# Altium schematic sheet RX_DP.SchDoc
size 431 x 279 mm; Organization: ORGANIZATION; Address1: ADDRESS 1; Address2: ADDRESS 2; Address3: ADDRESS 3; Address4: ADDRESS 4; Revision: -; SheetNumber: 1; SheetTotal: 8; ENG_APP_DATE: --/--/--; DSN_APP_DATE: --/--/--; CHK_APP_DATE: --/--/--
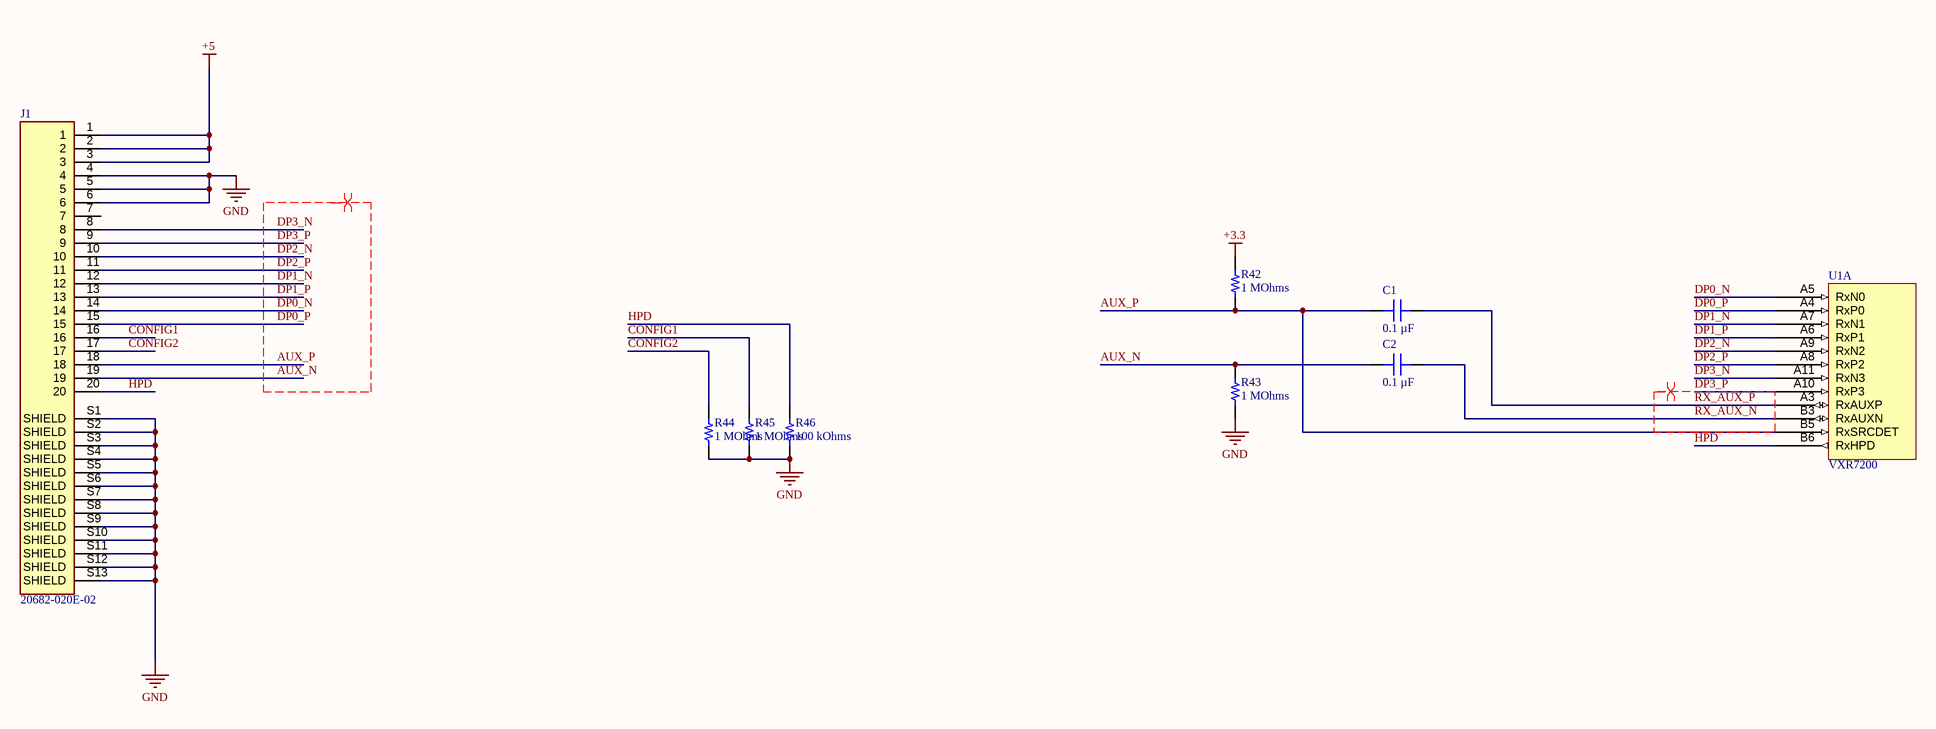
[diagram p0: RX_DP.SchDoc]

## Parts
C1  0.1 µF  [CAP 0201_0603]
C2  0.1 µF  [CAP 0201_0603]
J1  20682-020E-02  [IPEX_20682-020E-02]
R42  1 MOhms  [RES 0201_0603]
R43  1 MOhms  [RES 0201_0603]
R44  1 MOhms  [RES 0201_0603]
R45  1 MOhms  [RES 0201_0603]
R46  100 kOhms  [RES 0201_0603]
U1  VXR7200  [BGA100P9X9-81A]  (part A of 9)

## Nets
+3.3: R42.2
+5: J1.1 J1.2 J1.3
GND: J1.4 J1.5 J1.6 J1.S1(SHIELD) J1.S2(SHIELD) J1.S3(SHIELD) J1.S4(SHIELD) J1.S5(SHIELD) J1.S6(SHIELD) J1.S7(SHIELD) J1.S8(SHIELD) J1.S9(SHIELD) J1.S10(SHIELD) J1.S11(SHIELD) J1.S12(SHIELD) J1.S13(SHIELD) R43.1 R44.1 R45.1 R46.1
AUX_N: C2.1 J1.19 R43.2
AUX_P: C1.1 J1.18 R42.1 U1.B5(RxSRCDET)
CONFIG1: J1.16 R45.2
CONFIG2: J1.17 R44.2
DP0_N: J1.14 U1.A5(RxN0)
DP0_P: J1.15 U1.A4(RxP0)
DP1_N: J1.12 U1.A7(RxN1)
DP1_P: J1.13 U1.A6(RxP1)
DP2_N: J1.10 U1.A9(RxN2)
DP2_P: J1.11 U1.A8(RxP2)
DP3_N: J1.8 U1.A11(RxN3)
DP3_P: J1.9 U1.A10(RxP3)
HPD: J1.20 R46.2 U1.B6(RxHPD)
RX_AUX_N: C2.2 U1.B3(RxAUXN)
RX_AUX_P: C1.2 U1.A3(RxAUXP)

Not connected (* = marked no-connect by the designer): J1 7

## Layout directives
differential pair; net class DP; differential pair class DP: AUX_N, AUX_P, DP0_N, DP0_P, DP1_N, DP1_P, DP2_N, DP2_P, DP3_N, DP3_P, RX_AUX_N, RX_AUX_P

## Notes on the sheet
- DWG. NO.
- REV.
- SHT.
- REVISION
- DESCRIPTION
- DATE
- APPROVED
- ENG:
- APPROVALS
- PROJECT
- DSN:
- CHK:
- REFERENCE DOCUMENTS
- PROJECT REVISION:
- TITLE
- SimulaVR
- DOCUMENT REVISION:
- DESIGN ITEM:
- BOM:
- FAB DWG:
- PCB DWG:
- ASSY DWG:
- SCALE:
- SIZE
- B
- CAGE CODE
- FILE NAME
- DWG NO.
- SHEET
- OF
- REV

## Library data of the parts
C1 C2 = GRM033R61E104KE14D: CAP CER 0.1UF 25V X5R 0201; manufacturer: Murata Electronics; Tolerance: ±10%; Part Number: GRM033R61E104KE14D; Value: 0.1 µF; Applications: General Purpose; Capacitance: 0.1 µF; componentlink1description: Datasheet; componentlink1url: https://search.murata.co.jp/Ceramy/image/img/A01X/G101/ENG/GRM033R61E104KE14-01.pdf; componentlink2description: DigiKey Link; componentlink2url: https://www.digikey.com/en/products/detail/murata-electronics/GRM033R61E104KE14D/4904731; Device Package: 0201 (0603 Metric); lastupdated: 5/20/2022 2:33:00 PM; Lifecycle Status: Active; Minimum Order: 1; Mounting Type: Surface Mount; Operating Temperature: -55°C ~ 85°C; Package / Case: 0201 (0603 Metric); packaging: TapeAndReel; partid: 39731; Part Status: Active; price: 0.01; series: GRM; Size / Dimension: 0.024" L x 0.012" W (0.60mm x 0.30mm); Supplier 1: DigiKey; Supplier Part Number 1: 490-12686-1-ND; Temperature Coefficient: X5R; Thickness (Max): 0.013" (0.33mm); Voltage - Rated: 25V
J1 = 20682-020E-02: Cabline-CAII Rece. Ass'y; MF: {'manufacturer': u'I-PEX'}; Package: None; Price: None; MP: 20682-020E-02; Availability: Unavailable; Value: *
R42-R45 = CRCW02011M00FKED: RES SMD 1M OHM 1% 1/20W 0201; Manufacturer: Vishay Dale; Power (Watts): 0.05W, 1/20W; Temperature Coefficient: ±100ppm/°C; Part Number: CRCW02011M00FKED; Value: 1 MOhms; ComponentLink1Description: Datasheet; ComponentLink1URL: http://www.vishay.com/docs/20052/crcw0201e3.pdf; ComponentLink2Description: DigiKey Link; ComponentLink2URL: https://www.digikey.com/en/products/detail/vishay-dale/CRCW02011M00FKED/1968003; Composition: Thick Film; Device Package: 0201 (0603 Metric); Height - Seated (Max): 0.010" (0.26mm); LastUpdated: 2022-04-12 22:16:01; Lifecycle Status: Active; Minimum Order: 1; Number of Terminations: 2; Operating Temperature: -55°C ~ 155°C; Package / Case: 0201 (0603 Metric); Packaging: TapeAndReel; PartId: 30; Part Status: Active; Price: 0.03; Resistance: 1 MOhms; Series: CRCW; Size / Dimension: 0.024" L x 0.012" W (0.60mm x 0.30mm); Supplier 1: DigiKey; Supplier Part Number 1: 541-1.00MAABCT-ND; Supplier Device Package: 0201; Tolerance: ±1%
R46 = ERJ-U01F1003C: RES 100K OHM 1% 1/20W 0201 SMD; Manufacturer: Panasonic Electronic Components; Power (Watts): 0.05W, 1/20W; Temperature Coefficient: ±200ppm/°C; Part Number: ERJ-U01F1003C; Value: 100 kOhms; ComponentLink1Description: Datasheet; ComponentLink1URL: https://industrial.panasonic.com/cdbs/www-data/pdf/RDP0000/AOA0000C334.pdf; ComponentLink2Description: DigiKey Link; ComponentLink2URL: https://www.digikey.com/en/products/detail/panasonic-electronic-components/ERJ-U01F1003C/11631500; Composition: Thick Film; Device Package: 0201 (0603 Metric); Features: Anti-Sulfur; Height - Seated (Max): 0.010" (0.26mm); LastUpdated: 2022-04-12 22:15:26; Lifecycle Status: Active; Minimum Order: 1; Number of Terminations: 2; Operating Temperature: -55°C ~ 125°C; Package / Case: 0201 (0603 Metric); Packaging: TapeAndReel; PartId: 64617; Part Status: Active; Price: 0.05; Resistance: 100 kOhms; Series: ERJ-U01; Size / Dimension: 0.024" L x 0.012" W (0.60mm x 0.30mm); Supplier 1: DigiKey; Supplier Part Number 1: 10-ERJ-U01F1003CCT-ND; Supplier Device Package: 0201; Tolerance: ±1%
U1 = CMP-015-00008-4: VXR7200 DP to MIPI-DSI bridge